# Altium schematic sheet FPGA_Power.SchDoc: Sayma AMC
size 420 x 297 mm; $$Internal___BlkDate: 0:12:25_2-9-18; $$Internal_NAME_PLACEHOLDER: a3sheet; $$Internal_Resolution: 00001mm; $$NotCommonProperty_@NAME: FPGA_XCKU040FFVA1156; $$NotCommonProperty_@PRINTORDER: 22; $$NotCommonProperty_@SHEET: FPGA Power; $$NotCommonProperty_@SHEETTOTAL: 30; CmpIndex: 994; Drawing Author: G.Kasprowicz; Drawing Number: Sayma AMC; Drawing Project: AMC FMC Carrier Board; Drawing Revision: 2.0; SymIndex: 2141; CheckedBy: P.Kulik,T.Przywozki,W.Ruclo; Author: G.Kasprowicz; CompanyName: WUT ISE; DrawnBy: G.Kasprowicz; Organization: WUT ISE; Address1: PW ISE; Address2: Nowowiejska 15/19 00-665 Warsaw; Address3: gkasprow@gmail.com; DocumentNumber: 32; Revision: 2; SheetNumber: 32; SheetTotal: 32; ModifiedBy: -; CheckedDate: -; Title2: FPGA power ports; DivGrp: WUT ISE; Designer: G.Kasprowicz; ModifiedDate: -; ProjectName: Sensor Box
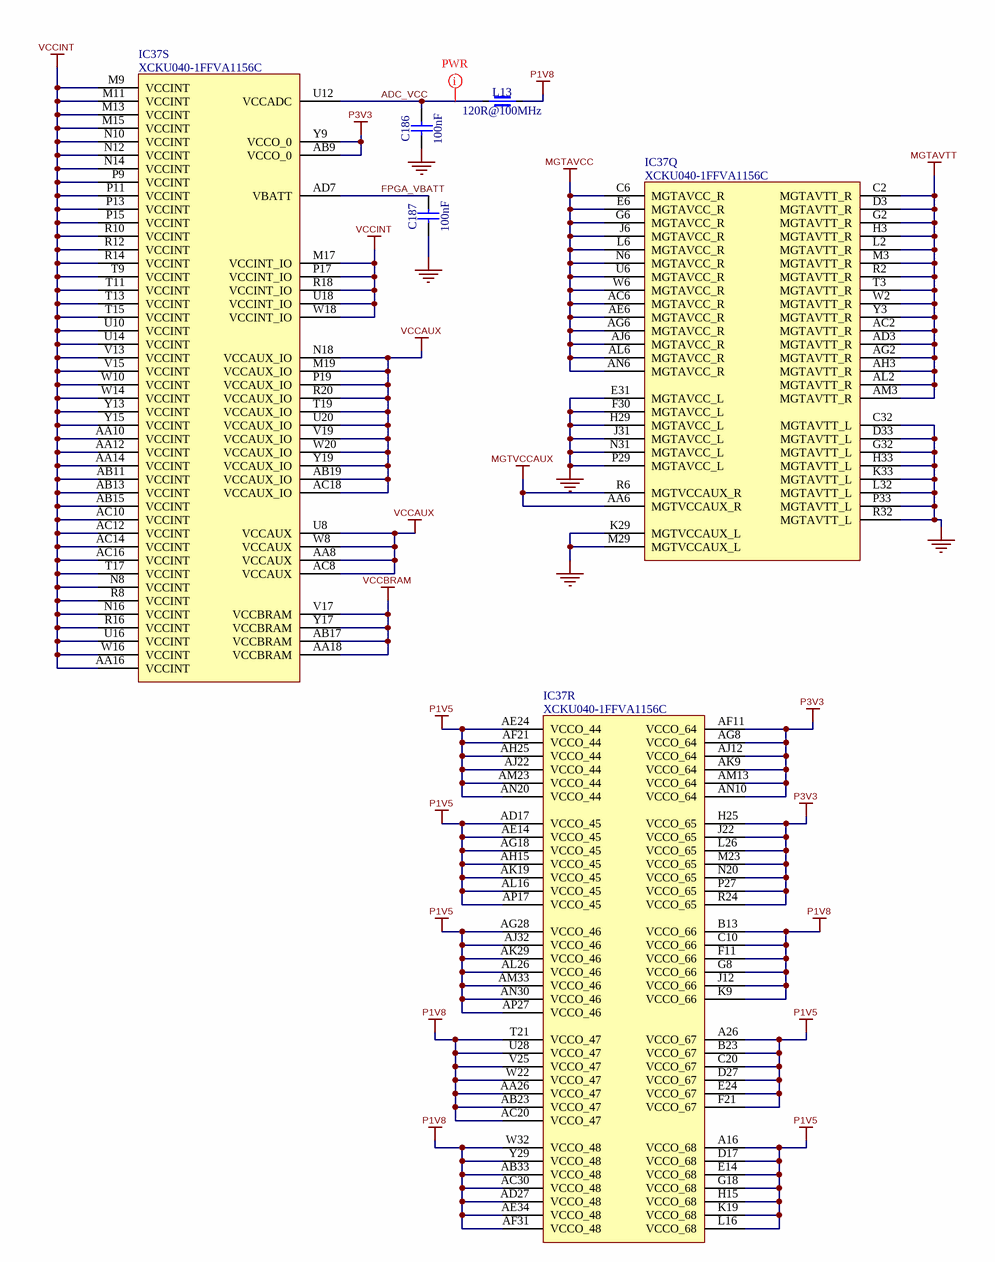
[diagram p0: FPGA_Power.SchDoc]

## Parts
C186  100nF  [CAPC0603X33N]
C187  100nF  [CAPC0603X33N]
IC37  XCKU040-1FFVA1156C  [BGA1156C100P34X34_3500X3500X350]  (parts Q,R,S of 22)
L13  120R@100MHz  [INDC1005X55N]

## Nets
GND: C186.1 C187.1 IC37.C32(MGTAVTT_L) IC37.D33(MGTAVTT_L) IC37.E31(MGTAVCC_L) IC37.F30(MGTAVCC_L) IC37.G32(MGTAVTT_L) IC37.H29(MGTAVCC_L) IC37.H33(MGTAVTT_L) IC37.J31(MGTAVCC_L) IC37.K29(MGTVCCAUX_L) IC37.K33(MGTAVTT_L) IC37.L32(MGTAVTT_L) IC37.M29(MGTVCCAUX_L) IC37.N31(MGTAVCC_L) IC37.P29(MGTAVCC_L) IC37.P33(MGTAVTT_L) IC37.R32(MGTAVTT_L)
MGTAVCC: IC37.AC6(MGTAVCC_R) IC37.AE6(MGTAVCC_R) IC37.AG6(MGTAVCC_R) IC37.AJ6(MGTAVCC_R) IC37.AL6(MGTAVCC_R) IC37.AN6(MGTAVCC_R) IC37.C6(MGTAVCC_R) IC37.E6(MGTAVCC_R) IC37.G6(MGTAVCC_R) IC37.J6(MGTAVCC_R) IC37.L6(MGTAVCC_R) IC37.N6(MGTAVCC_R) IC37.U6(MGTAVCC_R) IC37.W6(MGTAVCC_R)
MGTAVTT: IC37.AC2(MGTAVTT_R) IC37.AD3(MGTAVTT_R) IC37.AG2(MGTAVTT_R) IC37.AH3(MGTAVTT_R) IC37.AL2(MGTAVTT_R) IC37.AM3(MGTAVTT_R) IC37.C2(MGTAVTT_R) IC37.D3(MGTAVTT_R) IC37.G2(MGTAVTT_R) IC37.H3(MGTAVTT_R) IC37.L2(MGTAVTT_R) IC37.M3(MGTAVTT_R) IC37.R2(MGTAVTT_R) IC37.T3(MGTAVTT_R) IC37.W2(MGTAVTT_R) IC37.Y3(MGTAVTT_R)
MGTVCCAUX: IC37.AA6(MGTVCCAUX_R) IC37.R6(MGTVCCAUX_R)
P1V5: IC37.A16(VCCO_68) IC37.A26(VCCO_67) IC37.AD17(VCCO_45) IC37.AE14(VCCO_45) IC37.AE24(VCCO_44) IC37.AF21(VCCO_44) IC37.AG18(VCCO_45) IC37.AG28(VCCO_46) IC37.AH15(VCCO_45) IC37.AH25(VCCO_44) IC37.AJ22(VCCO_44) IC37.AJ32(VCCO_46) IC37.AK19(VCCO_45) IC37.AK29(VCCO_46) IC37.AL16(VCCO_45) IC37.AL26(VCCO_46) IC37.AM23(VCCO_44) IC37.AM33(VCCO_46) IC37.AN20(VCCO_44) IC37.AN30(VCCO_46) IC37.AP17(VCCO_45) IC37.AP27(VCCO_46) IC37.B23(VCCO_67) IC37.C20(VCCO_67) IC37.D17(VCCO_68) IC37.D27(VCCO_67) IC37.E14(VCCO_68) IC37.E24(VCCO_67) IC37.F21(VCCO_67) IC37.G18(VCCO_68) IC37.H15(VCCO_68) IC37.K19(VCCO_68) IC37.L16(VCCO_68)
P1V8: IC37.AA26(VCCO_47) IC37.AB23(VCCO_47) IC37.AB33(VCCO_48) IC37.AC20(VCCO_47) IC37.AC30(VCCO_48) IC37.AD27(VCCO_48) IC37.AE34(VCCO_48) IC37.AF31(VCCO_48) IC37.B13(VCCO_66) IC37.C10(VCCO_66) IC37.F11(VCCO_66) IC37.G8(VCCO_66) IC37.J12(VCCO_66) IC37.K9(VCCO_66) IC37.T21(VCCO_47) IC37.U28(VCCO_47) IC37.V25(VCCO_47) IC37.W22(VCCO_47) IC37.W32(VCCO_48) IC37.Y29(VCCO_48) L13.2
P3V3: IC37.AB9(VCCO_0) IC37.AF11(VCCO_64) IC37.AG8(VCCO_64) IC37.AJ12(VCCO_64) IC37.AK9(VCCO_64) IC37.AM13(VCCO_64) IC37.AN10(VCCO_64) IC37.H25(VCCO_65) IC37.J22(VCCO_65) IC37.L26(VCCO_65) IC37.M23(VCCO_65) IC37.N20(VCCO_65) IC37.P27(VCCO_65) IC37.R24(VCCO_65) IC37.Y9(VCCO_0)
VCCAUX: IC37.AA8(VCCAUX) IC37.AB19(VCCAUX_IO) IC37.AC8(VCCAUX) IC37.AC18(VCCAUX_IO) IC37.M19(VCCAUX_IO) IC37.N18(VCCAUX_IO) IC37.P19(VCCAUX_IO) IC37.R20(VCCAUX_IO) IC37.T19(VCCAUX_IO) IC37.U8(VCCAUX) IC37.U20(VCCAUX_IO) IC37.V19(VCCAUX_IO) IC37.W8(VCCAUX) IC37.W20(VCCAUX_IO) IC37.Y19(VCCAUX_IO)
VCCBRAM: IC37.AA18(VCCBRAM) IC37.AB17(VCCBRAM) IC37.V17(VCCBRAM) IC37.Y17(VCCBRAM)
VCCINT: IC37.AA10(VCCINT) IC37.AA12(VCCINT) IC37.AA14(VCCINT) IC37.AA16(VCCINT) IC37.AB11(VCCINT) IC37.AB13(VCCINT) IC37.AB15(VCCINT) IC37.AC10(VCCINT) IC37.AC12(VCCINT) IC37.AC14(VCCINT) IC37.AC16(VCCINT) IC37.M9(VCCINT) IC37.M11(VCCINT) IC37.M13(VCCINT) IC37.M15(VCCINT) IC37.M17(VCCINT_IO) IC37.N8(VCCINT) IC37.N10(VCCINT) IC37.N12(VCCINT) IC37.N14(VCCINT) IC37.N16(VCCINT) IC37.P9(VCCINT) IC37.P11(VCCINT) IC37.P13(VCCINT) IC37.P15(VCCINT) IC37.P17(VCCINT_IO) IC37.R8(VCCINT) IC37.R10(VCCINT) IC37.R12(VCCINT) IC37.R14(VCCINT) IC37.R16(VCCINT) IC37.R18(VCCINT_IO) IC37.T9(VCCINT) IC37.T11(VCCINT) IC37.T13(VCCINT) IC37.T15(VCCINT) IC37.T17(VCCINT) IC37.U10(VCCINT) IC37.U14(VCCINT) IC37.U16(VCCINT) IC37.U18(VCCINT_IO) IC37.V13(VCCINT) IC37.V15(VCCINT) IC37.W10(VCCINT) IC37.W14(VCCINT) IC37.W16(VCCINT) IC37.W18(VCCINT_IO) IC37.Y13(VCCINT) IC37.Y15(VCCINT)
ADC_VCC: C186.2 IC37.U12(VCCADC) L13.1
FPGA_VBATT: C187.2 IC37.AD7(VBATT)

## Layout directives
net class PWR: ADC_VCC

## Notes on the sheet
- Project/Equipment
- Document
- Designer
- Drawn by
- Check.by
- Copyright WUT ISE 2018.
  This documentation describes Open Hardware and is licensed under the CERN OHL v.1.1. You may redistribute and modify this documentation under the terms of the CERN OHL v.1.1. (http://ohwr.org/CERNOHL). This documentation is distributed WITHOUT ANY EXPRESS OR IMPLIED WARRANTY, INCLUDING OF MERCHANTABILITY, SATISFACTORY QUALITY AND FITNESS FOR A PARTICULAR PURPOSE. Please see the CERN OHL v.1.1 for applicable conditions.
- Contact
- File
- Last Mod.
- Print Date
- Sheet
- Size
- A3
- of
- Rev

## Library data of the parts
C186 C187 = CC0201_100NF_6.3V_10%_X5R: Non-polarised capacitor; Manufacturer: GENERIC; Part Description: SMD Multilayer Chip Ceramic Capacitor; Manufacturer1 Part Number: 02016D104KAT2A; Tolerance: ±10%; Voltage: 6.3V; TC: X5R; Manufacturer Part Number: CC0201_100NF_6.3V_10%_X5R; Part Number: CC0201_100NF_6.3V_10%_X5R; Value: 100nF; Component Kind: Standard; Component Type: Standard; Pin Count: 2; Status: Not Recommended; Case: 0201; Mounted: Yes; Socket: No; SMD: Yes; Sense: No; Manufacturer1 Example: AVX; Manufacturer1 ComponentHeight: 0.33mm; HelpURL: \\cern.ch\dfs\Applications\Altium\Datasheets\CC0201_X5R_AVX.pdf; Author: CERN DEM JLC; CreateDate: 03.12.2007; LatestRevisionDate: 03.12.2007
IC37 = XCKU040-1FFVA1156C: Kintex UltraScale FPGA, 520 I/O, 530K Cells, 1156-Ball BGA, Speed Grade 1, Commercial Grade; Manufacturer: XILINX; Part Description: Kintex UltraScale, 40 DLL I/O, 416 HP I/O, 104 HR I/O, 1156-Pin BGA, Speed Grade 1, Commercial Grade; PressFit: No; Bonding: No; PackageDescription: BGA, 1.00mm Pitch, Square; 1156 Pin, 34 Columns X 34 Rows, Body 35.00mm X 35.00mm X 3.50mm H, IPC Medium Density; Part Number: XCKU040-1FFVA1156C; Component Kind: Standard; Component Type: Standard; Device: XCKU040-1FFVA1156C; Manufacturer Part Number: XCKU040-1FFVA1156C; Pin Count: 1156; Case: BGA1156; Mounted: Yes; Socket: No; SMD: Yes; Sense: No; ComponentHeight: 3.5mm; HelpURL: \\cern.ch\dfs\Applications\Altium\Datasheets\XCKU040-1FFVA1156C.pdf; ComponentLink1URL: \\cern.ch\dfs\Applications\Altium\Datasheets\XCKU040-1FFVA1156C_Package-Pinout.pdf; ComponentLink1Description: Package/Pinout; Author: CERN DEM CA; CreateDate: 16.08.2016; LatestRevisionDate: 16.08.2016
L13 = IND0402_MURATA_BLM15PX121SN1D: Manufacturer: MURATA; Part Description: SMD EMIFIL Chip Ferrite Bead; Tolerance: ±25%; Power: 2A; Resistance: 0.055R; Manufacturer Part Number: BLM15PX121SN1D; Part Number: IND0402_MURATA_BLM15PX121SN1D; Value: 120R@100MHz; Component Kind: Standard; Component Type: Standard; Pin Count: 2; Status: None; Case: 0402; Mounted: Yes; Socket: No; SMD: Yes; Sense: No; ComponentHeight: 0.55mm; HelpURL: \\cern.ch\dfs\Applications\Altium\Datasheets\IND0402_MURATA_BLM15PX.pdf; Author: CERN DEM JMW; CreateDate: 19.02.2014; LatestRevisionDate: 25.10.2018